# Altium schematic sheet moto2.SchDoc
size A4
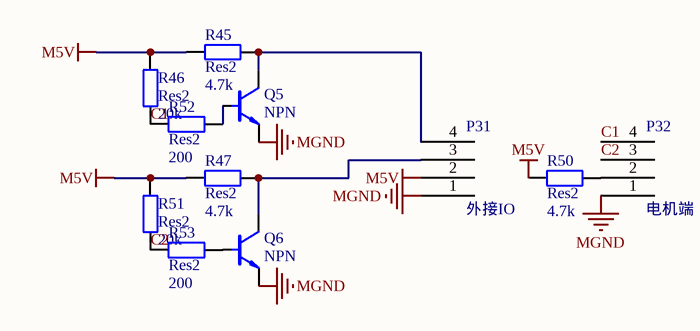
[diagram p0: moto2.SchDoc]

## Parts
P31  外接IO  [4针贴片接头2.0]
P32  电机端  [4针贴片接头2.0]
Q5  NPN  [LC-SOT-23]
Q6  NPN  [LC-SOT-23]
R45  Res2  value 4.7k  [LC-0603_R]
R46  Res2  value 20k  [LC-0603_R]
R47  Res2  value 4.7k  [LC-0603_R]
R50  Res2  value 4.7k  [LC-0603_R]
R51  Res2  value 20k  [LC-0603_R]
R52  Res2  value 200  [LC-0603_R]
R53  Res2  value 200  [LC-0603_R]

## Nets
M5V: P31.2 R45.1 R46.2 R47.1 R50.1 R51.2
MGND: P31.1 P32.1 Q5.E(e) Q6.E(e)
C1: P32.4 R46.1 R52.2
C2: P32.3 R51.1 R53.2
NetP31_3: P31.3 Q6.C(c) R47.2
NetP31_4: P31.4 Q5.C(c) R45.2
NetP32_2: P32.2 R50.2
NetQ5_B: Q5.B(b) R52.1
NetQ6_B: Q6.B(b) R53.1

## Library data of the parts
P31 P32 = 4线焊接点
Q5 Q6 = NPN: pin to pad: B>1 C>3 E>2
R45-R47 R50-R53 = Res2: Resistor; Published: 8-Jun-2000; LatestRevisionDate: 17-Jul-2002; LatestRevisionNote: Re-released for DXP Platform.; PackageReference: AXIAL-0.4; Publisher: Altium Limited